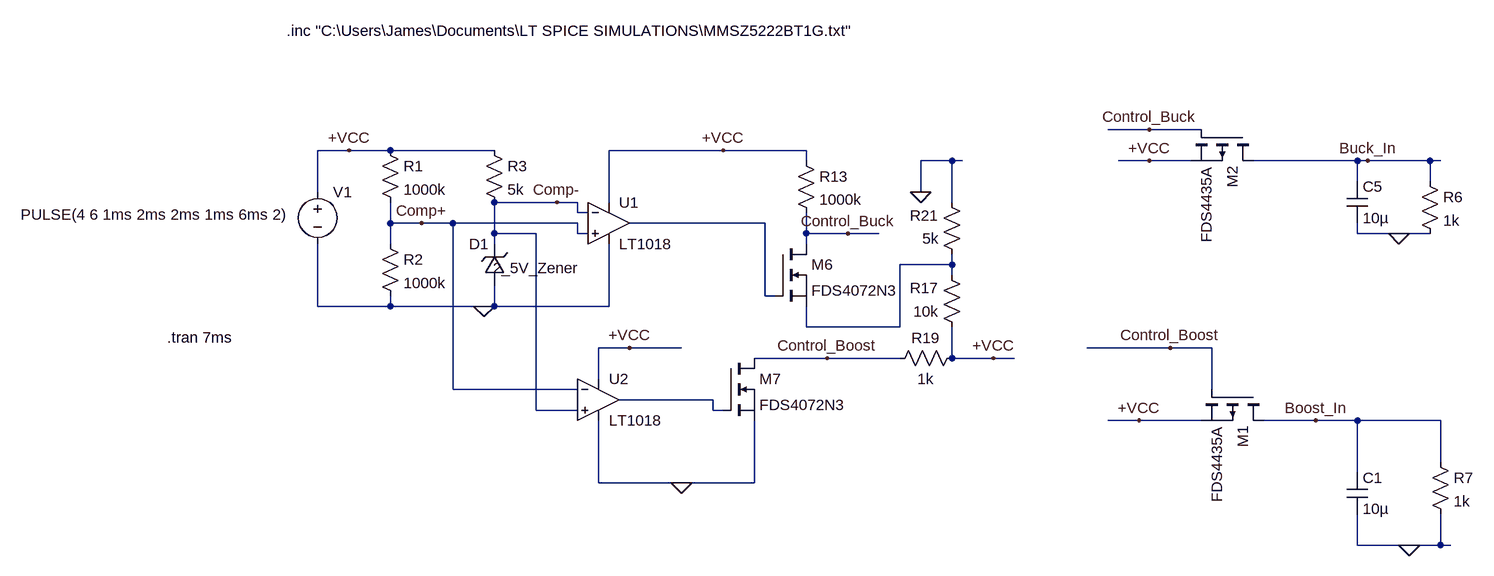
[diagram p0: schematic Converter Selection Controls (Buck and Boost).asc]
Converter Selection Controls (Buck and Boost).asc, the LTspice schematic file:
Version 4
SHEET 1 2088 1124
WIRE 432 -16 368 -16
WIRE 512 -16 432 -16
WIRE -800 16 -848 16
WIRE -736 16 -800 16
WIRE -576 16 -736 16
WIRE -224 16 -400 16
WIRE -96 16 -224 16
WIRE -96 32 -96 16
WIRE 128 32 80 32
WIRE 144 32 128 32
WIRE 432 32 384 32
WIRE 496 32 432 32
WIRE 752 32 592 32
WIRE 768 32 752 32
WIRE 864 32 768 32
WIRE 880 32 864 32
WIRE 752 64 752 32
WIRE 864 64 864 32
WIRE -848 80 -848 16
WIRE 80 80 80 32
WIRE -480 96 -576 96
WIRE -448 96 -480 96
WIRE -400 96 -400 16
WIRE 128 96 128 32
WIRE -448 112 -448 96
WIRE -432 112 -448 112
WIRE -736 128 -736 96
WIRE -688 128 -736 128
WIRE -640 128 -688 128
WIRE -448 128 -640 128
WIRE -160 128 -368 128
WIRE -576 144 -576 96
WIRE -512 144 -576 144
WIRE -448 144 -448 128
WIRE -432 144 -448 144
WIRE -96 144 -96 112
WIRE -32 144 -96 144
WIRE 16 144 -32 144
WIRE 752 144 752 128
WIRE 816 144 752 144
WIRE 864 144 816 144
WIRE -736 160 -736 128
WIRE -576 160 -576 144
WIRE -96 160 -96 144
WIRE 128 192 128 176
WIRE 128 192 48 192
WIRE 128 208 128 192
WIRE -160 240 -160 128
WIRE -144 240 -160 240
WIRE -848 256 -848 160
WIRE -736 256 -736 240
WIRE -736 256 -848 256
WIRE -592 256 -736 256
WIRE -576 256 -576 224
WIRE -576 256 -592 256
WIRE -400 256 -400 160
WIRE -400 256 -576 256
WIRE -96 288 -96 256
WIRE 48 288 48 192
WIRE 48 288 -96 288
WIRE -368 320 -416 320
WIRE -288 320 -368 320
WIRE 464 320 336 320
WIRE 528 320 464 320
WIRE -64 336 -176 336
WIRE 48 336 -64 336
WIRE 128 336 128 288
WIRE 192 336 128 336
WIRE 224 336 192 336
WIRE -416 368 -416 320
WIRE -640 384 -640 128
WIRE -448 384 -640 384
WIRE 528 384 528 320
WIRE -240 400 -384 400
WIRE -512 416 -512 144
WIRE -448 416 -512 416
WIRE -240 416 -240 400
WIRE -224 416 -240 416
WIRE 416 432 368 432
WIRE 512 432 416 432
WIRE 688 432 608 432
WIRE 752 432 688 432
WIRE 880 432 752 432
WIRE 880 496 880 432
WIRE 752 512 752 432
WIRE -416 528 -416 432
WIRE -288 528 -416 528
WIRE -176 528 -176 432
WIRE -176 528 -288 528
WIRE 752 624 752 576
WIRE 832 624 752 624
WIRE 880 624 880 576
WIRE 880 624 832 624
WIRE 896 624 880 624
FLAG -592 256 0
FLAG 80 80 0
FLAG -800 16 +VCC
FLAG 416 432 +VCC
FLAG 432 32 +VCC
FLAG 432 -16 Control_Buck
FLAG 464 320 Control_Boost
FLAG -32 144 Control_Buck
FLAG -224 16 +VCC
FLAG -368 320 +VCC
FLAG 192 336 +VCC
FLAG -64 336 Control_Boost
FLAG -288 528 0
FLAG 688 432 Boost_In
FLAG 768 32 Buck_In
FLAG 816 144 0
FLAG 832 624 0
FLAG -688 128 Comp+
FLAG -480 96 Comp-
SYMBOL res -752 0 R0
SYMATTR InstName R1
SYMATTR Value 1000k
SYMBOL res -752 144 R0
SYMATTR InstName R2
SYMATTR Value 1000k
SYMBOL res -592 0 R0
SYMATTR InstName R3
SYMATTR Value 5k
SYMBOL zener -560 224 R180
WINDOW 0 24 64 Left 2
WINDOW 3 -115 27 Left 2
SYMATTR InstName D1
SYMATTR Value 2_5V_Zener
SYMBOL voltage -848 64 R0
WINDOW 3 -457 51 Left 2
WINDOW 123 0 0 Left 2
WINDOW 39 0 0 Left 2
SYMATTR Value PULSE(4 6 1ms 2ms 2ms 1ms 6ms 2)
SYMATTR InstName V1
SYMBOL cap 736 512 R0
SYMATTR InstName C1
SYMATTR Value 10µ
SYMBOL pmos 608 384 R90
SYMATTR InstName M1
SYMATTR Value FDS4435A
SYMBOL pmos 592 -16 R90
SYMATTR InstName M2
SYMATTR Value FDS4435A
SYMBOL res -112 16 R0
SYMATTR InstName R13
SYMATTR Value 1000k
SYMBOL nmos -144 160 R0
SYMATTR InstName M6
SYMATTR Value FDS4072N3
SYMBOL nmos -224 336 R0
SYMATTR InstName M7
SYMATTR Value FDS4072N3
SYMBOL res 144 320 R90
WINDOW 0 0 56 VBottom 2
WINDOW 3 32 56 VTop 2
SYMATTR InstName R19
SYMATTR Value 1k
SYMBOL res 144 304 R180
WINDOW 0 36 76 Left 2
WINDOW 3 36 40 Left 2
SYMATTR InstName R17
SYMATTR Value 10k
SYMBOL res 144 192 R180
WINDOW 0 36 76 Left 2
WINDOW 3 36 40 Left 2
SYMATTR InstName R21
SYMATTR Value 5k
SYMBOL cap 736 64 R0
SYMATTR InstName C5
SYMATTR Value 10µ
SYMBOL res 848 48 R0
SYMATTR InstName R6
SYMATTR Value 1k
SYMBOL res 864 480 R0
SYMATTR InstName R7
SYMATTR Value 1k
SYMBOL Comparators\\LT1018 -400 128 R0
SYMATTR InstName U1
SYMBOL Comparators\\LT1018 -416 400 R0
SYMATTR InstName U2
TEXT -1080 304 Left 2 !.tran 7ms
TEXT -896 -168 Left 2 !.inc "C:\\Users\\James\\Documents\\LT SPICE SIMULATIONS\\MMSZ5222BT1G.txt"

The netlist it stands for:
* Converter Selection Controls (Buck and Boost).asc
R1 +VCC Comp+ 1000k
R2 Comp+ 0 1000k
R3 +VCC Comp- 5k
D1 0 Comp- 2_5V_Zener
V1 +VCC 0 PULSE(4 6 1ms 2ms 2ms 1ms 6ms 2)
C1 Boost_In 0 10µ
M1 Boost_In Control_Boost +VCC +VCC FDS4435A
M2 Buck_In Control_Buck +VCC +VCC FDS4435A
R13 +VCC Control_Buck 1000k
M6 Control_Buck N001 N002 N002 FDS4072N3
M7 Control_Boost N003 0 0 FDS4072N3
R19 +VCC Control_Boost 1k
R17 +VCC N002 10k
R21 N002 0 5k
C5 Buck_In 0 10µ
R6 Buck_In 0 1k
R7 Boost_In 0 1k
XU1 Comp+ Comp- +VCC 0 N001 LT1018  ; pins In+ In- V+ V- OUT
XU2 Comp- Comp+ +VCC 0 N003 LT1018  ; pins In+ In- V+ V- OUT
.model D D
.lib standard.dio
.model NMOS NMOS
.model PMOS PMOS
.lib standard.mos
.tran 7ms
.inc "C:\Users\James\Documents\LT SPICE SIMULATIONS\MMSZ5222BT1G.txt"
.lib LTC1.lib
.backanno
.end